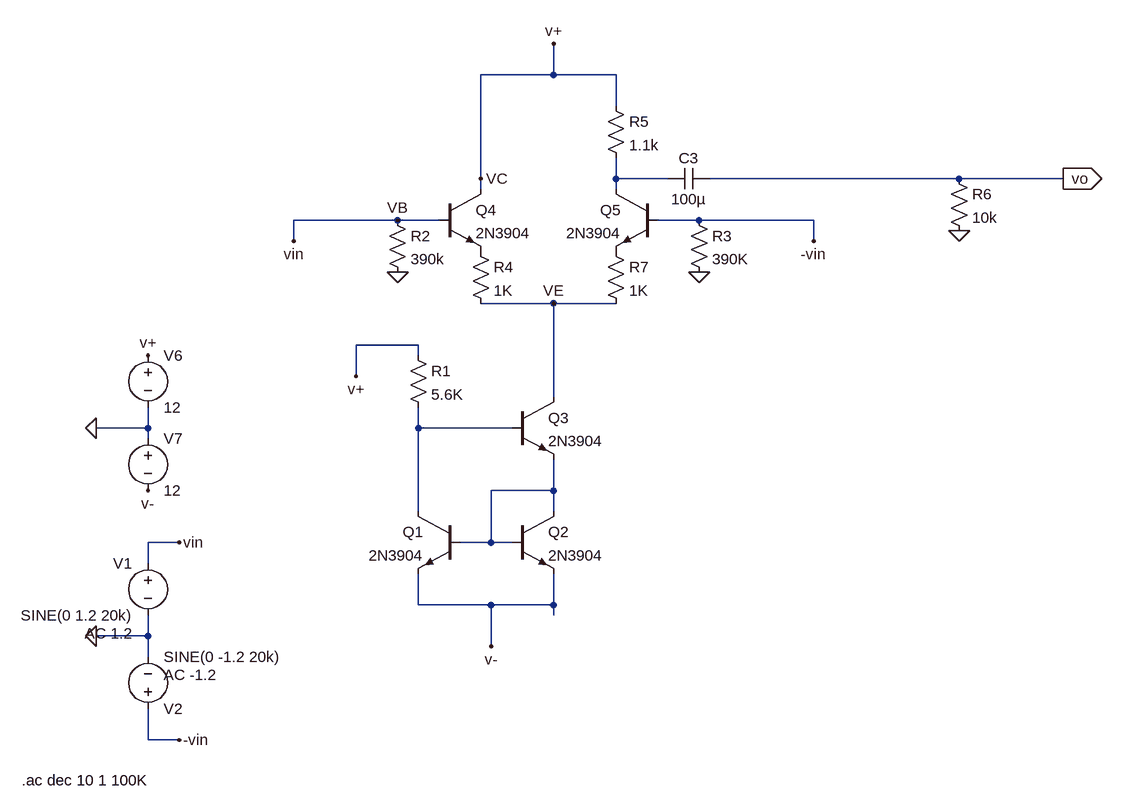
[diagram p0: schematic diferencial_RE1K_valorescomerciales.asc]
diferencial_RE1K_valorescomerciales.asc, the LTspice schematic file:
Version 4
SHEET 1 1176 680
WIRE 304 -448 304 -496
WIRE 304 -448 192 -448
WIRE 400 -448 304 -448
WIRE 400 -400 400 -448
WIRE 192 -288 192 -448
WIRE 400 -288 400 -320
WIRE 480 -288 400 -288
WIRE 928 -288 544 -288
WIRE 1088 -288 928 -288
WIRE 192 -272 192 -288
WIRE 400 -272 400 -288
WIRE 64 -224 -96 -224
WIRE 128 -224 64 -224
WIRE 528 -224 464 -224
WIRE 704 -224 528 -224
WIRE -96 -192 -96 -224
WIRE 704 -192 704 -224
WIRE 304 -96 192 -96
WIRE 400 -96 304 -96
WIRE 96 -32 0 -32
WIRE 96 -16 96 -32
WIRE 0 16 0 -32
WIRE 304 48 304 -96
WIRE -320 96 -320 64
WIRE -320 96 -400 96
WIRE 96 96 96 64
WIRE 240 96 96 96
WIRE -320 112 -320 96
WIRE 304 192 304 144
WIRE 304 192 208 192
WIRE 96 224 96 96
WIRE 304 224 304 192
WIRE -272 272 -320 272
WIRE 208 272 208 192
WIRE 208 272 160 272
WIRE 240 272 208 272
WIRE -320 304 -320 272
WIRE 96 368 96 320
WIRE 208 368 96 368
WIRE 304 368 304 320
WIRE 304 368 208 368
WIRE 304 384 304 368
WIRE -320 416 -320 384
WIRE -320 416 -400 416
WIRE 208 432 208 368
WIRE -320 448 -320 416
WIRE -320 576 -320 528
WIRE -272 576 -320 576
FLAG 1088 -288 vo
IOPIN 1088 -288 Out
FLAG 928 -208 0
FLAG 64 -224 VB
FLAG 304 -96 VE
FLAG 192 -288 VC
FLAG -320 192 v-
FLAG 0 16 v+
FLAG 208 432 v-
FLAG -320 -16 v+
FLAG 64 -144 0
FLAG 528 -144 0
FLAG 304 -496 v+
FLAG -400 96 0
FLAG -272 272 vin
FLAG -96 -192 vin
FLAG 704 -192 -vin
FLAG -272 576 -vin
FLAG -400 416 0
DATAFLAG 1104 -288 ""
SYMBOL npn 160 224 M0
SYMATTR InstName Q1
SYMATTR Value 2N3904
SYMBOL npn 240 224 R0
SYMATTR InstName Q2
SYMATTR Value 2N3904
SYMBOL npn 240 48 R0
SYMATTR InstName Q3
SYMATTR Value 2N3904
SYMBOL res 80 -32 R0
SYMATTR InstName R1
SYMATTR Value 5.6K
SYMBOL npn 128 -272 R0
SYMATTR InstName Q4
SYMATTR Value 2N3904
SYMBOL npn 464 -272 M0
SYMATTR InstName Q5
SYMATTR Value 2N3904
SYMBOL res 48 -240 R0
SYMATTR InstName R2
SYMATTR Value 390k
SYMBOL res 512 -240 R0
SYMATTR InstName R3
SYMATTR Value 390K
SYMBOL res 384 -416 R0
SYMATTR InstName R5
SYMATTR Value 1.1k
SYMBOL cap 544 -304 R90
WINDOW 0 0 32 VBottom 2
WINDOW 3 32 32 VTop 2
SYMATTR InstName C3
SYMATTR Value 100µ
SYMBOL res 912 -304 R0
SYMATTR InstName R6
SYMATTR Value 10k
SYMBOL voltage -320 -32 R0
WINDOW 123 0 0 Left 2
WINDOW 39 0 0 Left 2
SYMATTR InstName V6
SYMATTR Value 12
SYMBOL voltage -320 96 R0
WINDOW 123 0 0 Left 2
WINDOW 39 0 0 Left 2
SYMATTR InstName V7
SYMATTR Value 12
SYMBOL res 176 -192 R0
SYMATTR InstName R4
SYMATTR Value 1K
SYMBOL res 384 -192 R0
SYMATTR InstName R7
SYMATTR Value 1K
SYMBOL voltage -320 288 M0
WINDOW 123 24 124 Left 2
WINDOW 39 0 0 Left 2
SYMATTR Value2 AC 1.2
SYMATTR InstName V1
SYMATTR Value SINE(0 1.2 20k)
SYMBOL voltage -320 544 M180
WINDOW 123 24 68 Left 2
WINDOW 39 0 0 Left 2
SYMATTR Value2 AC -1.2
SYMATTR InstName V2
SYMATTR Value SINE(0 -1.2 20k)
TEXT -514 638 Left 2 !.ac dec 10 1 100K

The netlist it stands for:
* diferencial_RE1K_valorescomerciales.asc
Q1 N002 N003 v- 0 2N3904
Q2 N003 N003 v- 0 2N3904
Q3 VE N002 N003 0 2N3904
R1 v+ N002 5.6K
Q4 v+ vin P001 0 2N3904
Q5 N001 -vin P002 0 2N3904
R2 vin 0 390k
R3 -vin 0 390K
R5 v+ N001 1.1k
C3 vo N001 100µ
R6 vo 0 10k
V6 v+ 0 12
V7 0 v- 12
R4 P001 VE 1K
R7 P002 VE 1K
V1 vin 0 SINE(0 1.2 20k) AC 1.2
V2 -vin 0 SINE(0 -1.2 20k) AC -1.2
.model NPN NPN
.model PNP PNP
.lib standard.bjt
.ac dec 10 1 100K
.backanno
.end